# Altium schematic sheet Power.SchDoc: Circuit Power
size A; Author: Jesse Fernandez; CompanyName: GVSU; DrawnBy: Jesse Fernandez; Organization: Kennedy Hall of Engineering; Address1: 301 Fulton St. W; Address2: Grand Rapids, MI 49504; DocumentNumber: 1; Revision: 0.1; SheetNumber: 1; SheetTotal: 7
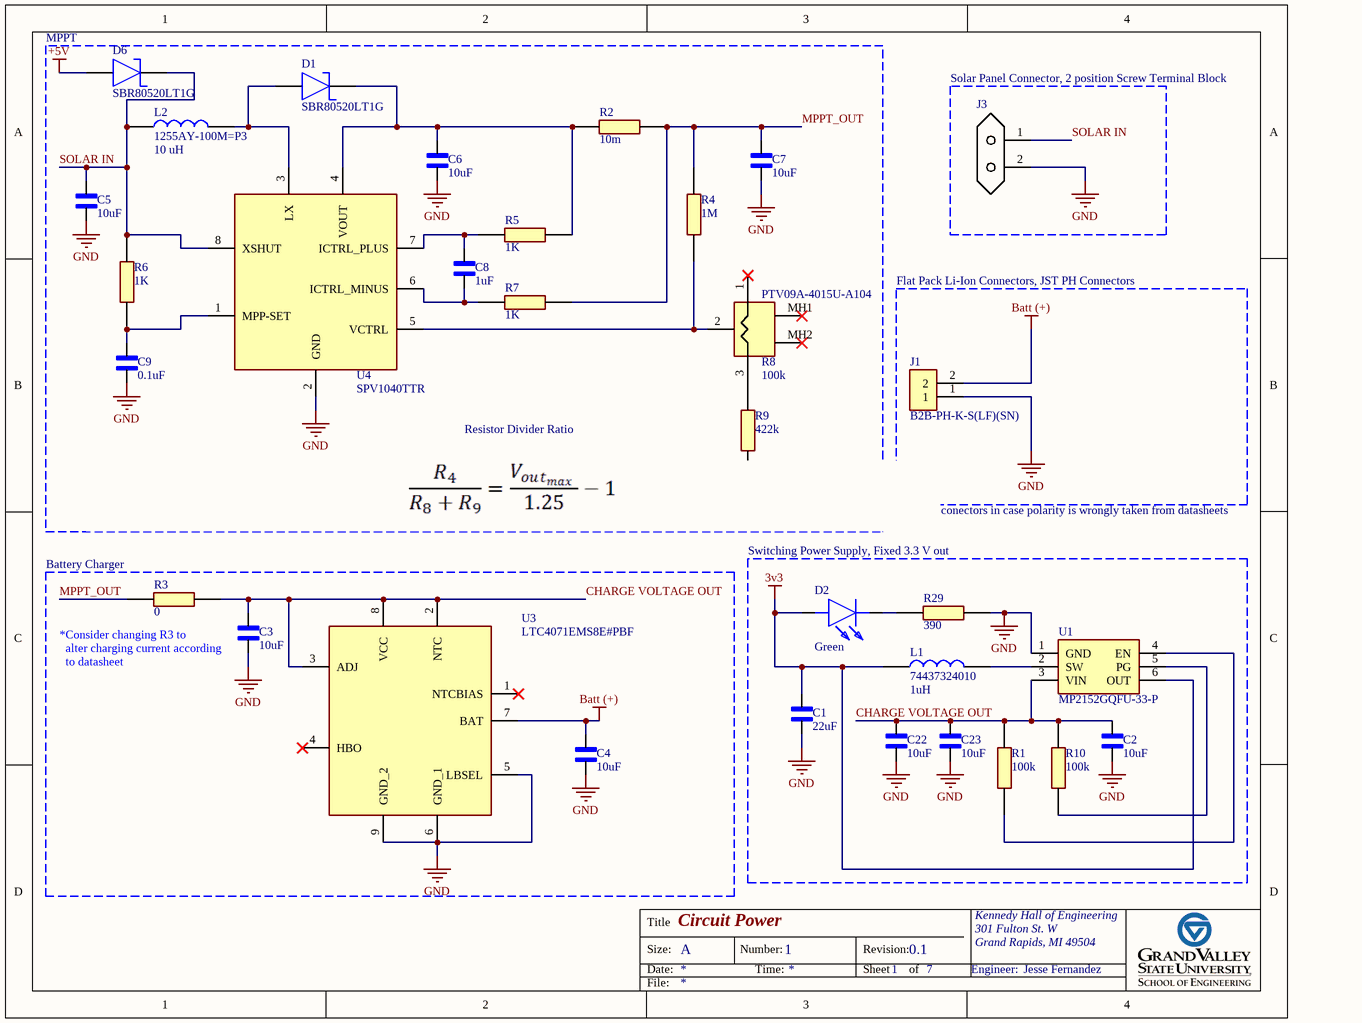
[diagram p0: Power.SchDoc]

## Parts
C1  value 22uF  [CAPC1005X55N]  (hidden comment: Multilayer Ceramic Cap. 0402 (1005 Metric))
C2  value 10uF  [CAPC1005X55N]  (hidden comment: Multilayer Ceramic Cap. 0402 (1005 Metric))
C3  value 10uF  [CAPC1005X55N]  (hidden comment: Multilayer Ceramic Cap. 0402 (1005 Metric))
C4  value 10uF  [CAPC1005X55N]  (hidden comment: Multilayer Ceramic Cap. 0402 (1005 Metric))
C5  value 10uF  [CAPC1005X55N]  (hidden comment: Multilayer Ceramic Cap. 0402 (1005 Metric))
C6  value 10uF  [CAPC1005X55N]  (hidden comment: Multilayer Ceramic Cap. 0402 (1005 Metric))
C7  value 10uF  [CAPC1005X55N]  (hidden comment: Multilayer Ceramic Cap. 0402 (1005 Metric))
C8  value 1uF  [CAPC1005X55N]  (hidden comment: Multilayer Ceramic Cap. 0402 (1005 Metric))
C9  value 0.1uF  [CAPC1005X55N]  (hidden comment: Multilayer Ceramic Cap. 0402 (1005 Metric))
C22  value 10uF  [CAPC1005X55N]  (hidden comment: Multilayer Ceramic Cap. 0402 (1005 Metric))
C23  value 10uF  [CAPC1005X55N]  (hidden comment: Multilayer Ceramic Cap. 0402 (1005 Metric))
D1  SBR80520LT1G  [Diode SOD-123-2]
D2  Color: Green  [SML-LX0201UPGC-TR]  (hidden comment: SML-LX0201UPGC-TR)
D6  SBR80520LT1G  [Diode SOD-123-2]
J1  B2B-PH-K-S(LF)(SN)  [B2B-PH-K-S(LF)(SN)]
J3  Two-Position Terminal Block  [TB001-500-02BE]  (value not drawn)
L1  74437324010  value 1uH  [Shielded Power Inductor]
L2  1255AY-100M=P3  value 10 uH  [1255AY-100M=P3]
R1  value 100k  [Thin-Film Resistor 0402 (1005 Metric)]  (hidden comment: Resistor 0402 (1005 Metric))
R2  value 10m  [Thin-Film Resistor 0402 (1005 Metric)]  (hidden comment: Resistor 0402 (1005 Metric))
R3  value 0  [Resistor 0603]  (hidden comment: Resistor 0603)
R4  value 1M  [Thin-Film Resistor 0402 (1005 Metric)]  (hidden comment: Resistor 0402 (1005 Metric))
R5  value 1K  [Thin-Film Resistor 0402 (1005 Metric)]  (hidden comment: Resistor 0402 (1005 Metric))
R6  value 1K  [Thin-Film Resistor 0402 (1005 Metric)]  (hidden comment: Resistor 0402 (1005 Metric))
R7  value 1K  [Thin-Film Resistor 0402 (1005 Metric)]  (hidden comment: Resistor 0402 (1005 Metric))
R8  PTV09A-4015U-A104  value 100k  [PTV09A-4015U-A104]
R9  value 422k  [Thin-Film Resistor 0402 (1005 Metric)]  (hidden comment: Resistor 0402 (1005 Metric))
R10  value 100k  [Thin-Film Resistor 0402 (1005 Metric)]  (hidden comment: Resistor 0402 (1005 Metric))
R29  value 390  [Thin-Film Resistor 0402 (1005 Metric)]  (hidden comment: Resistor 0402 (1005 Metric))
U1  MP2152GQFU-33-P  [MP2152GQFU-33-P]
U3  LTC4071EMS8E#PBF  [LTC4071EMS8E#PBF]
U4  SPV1040TTR  [SPV1040TTR]

## Blocks framed on the sheet
Solar Panel Connector, 2 position Screw Terminal Block: J3
Flat Pack Li-Ion Connectors, JST PH Connectors: J1
Battery Charger: C3 C4 R3 U3
Switching Power Supply, Fixed 3.3 V out: C1 C2 C22 C23 D2 L1 R1 R10 R29 U1

## Nets
3v3: C1.2 D2.2(A) L1.1 U1.6(OUT)
+5V: D6.2(A)
Batt (+): C4.2 J1.2 U3.7(BAT)
GND: C1.1 C2.1 C3.1 C4.1 C5.1 C6.1 C7.1 C9.1 C22.1 C23.1 J1.1 J3.2 R9.1 R29.2 U1.1(GND) U3.5(LBSEL) U3.6(GND_1) U3.9(GND_2) U4.2(GND)
CHARGE VOLTAGE OUT: C2.2 C3.2 C22.2 C23.2 R1.2 R3.2 R10.2 U1.3(VIN) U3.2(NTC) U3.3(ADJ) U3.8(VCC)
MPPT_OUT: C7.2 R2.2 R3.1 R4.2 R7.1
SOLAR IN: C5.2 D6.1(K) J3.1 L2.1 R6.2 U4.8(XSHUT)
NetC6_2: C6.2 D1.1(K) R2.1 R5.1 U4.4(VOUT)
NetC8_1: C8.1 R7.2 U4.6(ICTRL_MINUS)
NetC8_2: C8.2 R5.2 U4.7(ICTRL_PLUS)
NetC9_2: C9.2 R6.1 U4.1(MPP-SET)
NetD1_2: D1.2(A) L2.2 U4.3(LX)
NetD2_1: D2.1(K) R29.1
NetL1_2: L1.2 U1.2(SW)
NetR1_1: R1.1 U1.4(EN)
NetR4_1: R4.1 R8.2(WIPER) U4.5(VCTRL)
NetR8_3: R8.3(CW) R9.2
NetR10_1: R10.1 U1.5(PG)

Not connected (* = marked no-connect by the designer): R8 1(CCW)* MH1* MH2*; U3 1(NTCBIAS)* 4(HBO)*

## Notes on the sheet
- (near D6) MPPT
- Resistor Divider Ratio
- *Two conectors in case polarity is wrongly taken from datasheets
- (near C3) *Consider changing R3 to
  alter charging current according
  to datasheet
- Title
- Size:
- Date:
- A
- Number:
- Time:
- Revision:
- Sheet
- of
- Engineer:
- File:

## Library data of the parts
C1 = Multilayer Ceramic Cap. 0402 (1005 Metric): Capacitor X6S 0402 (1005 Metric); Manufacturer: Samsung Electro-Mechanics; Manufacturer P/N: GRM155R60J106ME05J; Vendor: Mouser; Vendor P/N: 187-CL05A226MQ5N6J8; Tolerance: 20%; Price: $0.52; ComponentLink1Description: Datasheet; ComponentLink1URL: *
C2-C7 C22 C23 = Multilayer Ceramic Cap. 0402 (1005 Metric): Capacitor X6S 0402 (1005 Metric); Manufacturer: Murata Electronics; Manufacturer P/N: GRM155R60J106ME05J; Vendor: Mouser; Vendor P/N: 81-GRM155R60J106ME05; Tolerance: 20%; Price: $0.15; ComponentLink1Description: Datasheet; ComponentLink1URL: *
C8 = Multilayer Ceramic Cap. 0402 (1005 Metric): Capacitor X6S 0402 (1005 Metric); Manufacturer: Murata Electronics; Manufacturer P/N: GRM155R70J105KA12J; Vendor: Mouser; Vendor P/N: 81-GRM155R70J105KA2J; Tolerance: 10%; Price: $0.11; ComponentLink1Description: Datasheet; ComponentLink1URL: *
C9 = Multilayer Ceramic Cap. 0402 (1005 Metric): Capacitor X6S 0402 (1005 Metric); Manufacturer: Murata Electronics; Manufacturer P/N: GRM155R71H104KE14D; Vendor: Mouser; Vendor P/N: 81-GRM155R71H104KE4D; Tolerance: 10%; Price: $0.10; ComponentLink1Description: Datasheet; ComponentLink1URL: *
D1 D6 = SBR80520LT1G: Schottky Diodes & Rectifiers REC SPCL SKTKY; Manufacturer: ON Semiconductor; Vendor: Mouser; Vendor P/N: 863-SBR80520LT1G; Manufacturer P/N: SBR80520LT1G; Price: $0.43; ComponentLink1Description: Datasheet; ComponentLink1URL: https://www.mouser.com/datasheet/2/308/MBR0520LT1_D-1810808.pdf
D2 = SML-LX0201UPGC-TR: Standard LEDs - SMD 0201 SMD LEDs 520nm Green; Manufacturer: Lumex; Vendor: Mouser; Vendor P/N: 696-SMLLX0201UPGCTR; V_forward: 2.7 [V]; I_forward: 2 [mA]; Manufacturer P/N: SML-LX0201UPGC-TR; Price: $0.47; ComponentLink1Description: Datasheet; ComponentLink1URL: https://www.mouser.com/datasheet/2/244/Lumex_07252017_SML-LX0201UPGC-TR%20(S-0)-1176641.pdf
J1 = B2B-PH-K-S(LF)(SN): Connector Header Through Hole 2 position 0.079" (2.00mm); Manufacturer: JST Sales America Inc.; Vendor: Digikey Corp; Vendor P/N: 455-1704-ND; Manufacturer P/N: B2B-PH-K-S(LF)(SN); ComponentLink2Description: Datasheet; ComponentLink2URL: https://www.jst-mfg.com/product/pdf/eng/ePH.pdf; Price: $0.17
J3 = TB001-500-02BE: Fixed Terminal Blocks Terminal block, screw type, 5.00, horizontal, 2 poles, CUI Blue, slotted screw, PCB mount; Manufacturer: CUI Devices; Vendor: Mouser; Vendor P/N: 490-TB001-500-02BE; Manufacturer P/N: TB001-500-02BE; Price: $0.58; ComponentLink1Description: DataSheet; ComponentLink1URL: https://www.cuidevices.com/product/resource/tb001-500.pdf
L1 = 74437324010: Shieled Power Inductor; Manufacturer: Wurth Elektronik; Vendor: Mouser; Vendor P/N: 710-74437324010; Manufacturer P/N: 74437324010; Price: 2.20; ComponentLink1Description: Datasheet; ComponentLink1URL: *; Series: WE-LHMI
L2 = 1255AY-100M=P3: Fixed Inductors 10uH 56.4mOhms3.1A +/-20% 6.3x6.3x4.5mm; Manufacturer: Murata Electronics; Vendor: Mouser; Vendor P/N: 81-1255AY-100MP3; Manufacturer P/N: 1255AY-100M=P3; Price: $0.47; ComponentLink1Description: Datasheet; ComponentLink1URL: https://www.mouser.com/datasheet/2/281/product-1023225.pdf
R1 R10 = Resistor 0402 (1005 Metric): Resistor, 0402 Package size; Manufacturer: Vishay / Dale; Manfacturer P/N: RCS0402100KFKED; Vendor: Mouser; Vendor P/N: 71-RCS0402100KFKED; Tolerance: 1%; Price: $0.12; ComponentLink1Description: Datasheet; ComponentLink1URL: *
R2 = Resistor 0402 (1005 Metric): Resistor, 0402 Package size; Manufacturer: Panasonic; Manfacturer P/N: ERJ-2LWFR010X; Vendor: Mouser; Vendor P/N: 667-ERJ-2LWFR010X; Tolerance: 1%; Price: $0.39; ComponentLink1Description: Datasheet; ComponentLink1URL: *
R3 = Resistor 0603: Manufacturer: Vishay / Dale; Manufacturer P/N: CRCW06030000Z0EA; Vendor: Mouser; Vendor P/N: 71-CRCW0603-0-E3; Tolerance: *tolerance*; Price: $0.10
R4 = Resistor 0402 (1005 Metric): Resistor, 0402 Package size; Manufacturer: Vishay / Dale; Manfacturer P/N: CRCW04021M00FKEDHP; Vendor: Mouser; Vendor P/N: 71-CRCW04021M00FKEDH; Tolerance: 1%; Price: $0.14; ComponentLink1Description: Datasheet; ComponentLink1URL: *
R5-R7 = Resistor 0402 (1005 Metric): Resistor, 0402 Package size; Manufacturer: Vishay / Dale; Manfacturer P/N: CRCW04021K00FKEDHP; Vendor: Mouser; Vendor P/N: 71-CRCW04021K00FKEDH; Tolerance: 1%; Price: $0.14; ComponentLink1Description: Datasheet; ComponentLink1URL: *
R8 = PTV09A-4015U-A104: Potentiometers PANEL CONTROL - 9MM-ST-CA 100 kohms 15 mm; Manufacturer: Bourns; Vendor: Mouser; Vendor P/N: 652-PTV09A-4015UA104; Manufacturer P/N: PTV09A-4015U-A104; ComponentLink1Description: Datasheet; ComponentLink1URL: https://www.mouser.com/datasheet/2/54/ptv09-777818.pdf; Price: $0.79
R9 = Resistor 0402 (1005 Metric): Resistor, 0402 Package size; Manufacturer: Panasonic; Manfacturer P/N: ERJ-2RKF4223X; Vendor: Mouser; Vendor P/N: 667-ERJ-2RKF4223X; Tolerance: 1%; Price: $0.10; ComponentLink1Description: Datasheet; ComponentLink1URL: *
R29 = Resistor 0402 (1005 Metric): Resistor, 0402 Package size; Manufacturer: Yageo; Manfacturer P/N: RC0402FR-07390RL; Vendor: Mouser; Vendor P/N: 603-RC0402FR-07390RL; Tolerance: 1%; Price: $0.10; ComponentLink1Description: Datasheet; ComponentLink1URL: *
U1 = MP2152GQFU-33-P: Switching Voltage Regulators 5.5V,2A,Sync Step-Down Converter with 25A IQ and Output Discharge in QFN and SOT563 Packages; Manufacturer: Monolithic Power Systems (MPS); Vendor: Mouser; Vendor P/N: 946-MP2152GQFU-33-P; Manufacturer P/N: MP2152GQFU-33-P; Price: $1.45; ComponentLink1Description: Datasheet; ComponentLink1URL: https://www.mouser.com/datasheet/2/277/MP2152-1624343.pdf
U3 = LTC4071EMS8E#PBF: Battery Management Li-Ion/Polymer Shunt Battery Charger System with Low Battery Disconnect; Manufacturer: Analog Devices; Vendor: Mouser; Vendor P/N: 584-LTC4071EMS8E#PBF; Manufacturer P/N: LTC4071EMS8E#PBF; Price: 5.81; ComponentLink1Description: Datasheet; ComponentLink1URL: https://www.mouser.com/datasheet/2/609/LTC4071-1775971.pdf
U4 = SPV1040TTR: Switching Voltage Regulators Hi Eff Solar Charger MPPT 0.3V to 5.5V; Manufacturer: STMicroelectronics; Vendor: Mouser; Vendor P/N: 511-SPV1040TTR; Manufacturer P/N: SPV1040TTR; Price: $3.16; ComponentLink1Description: Datasheet; ComponentLink1URL: https://www.mouser.com/datasheet/2/389/cd00287506-1797268.pdf